# EAGLE schematic Teensy-Maxuino-Slave (EAGLE 6.4)
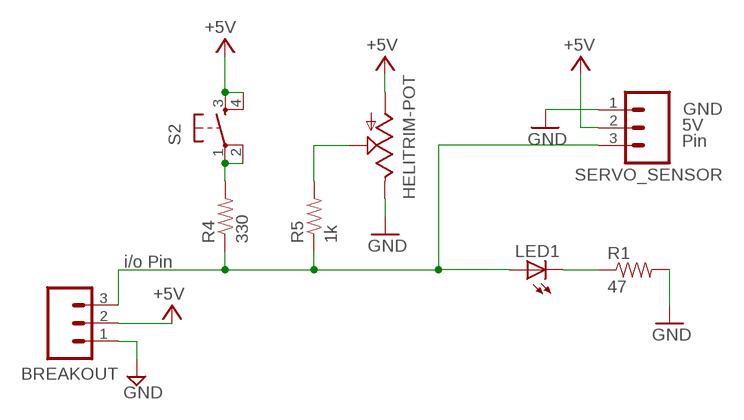
[diagram p0: schematic, sheet 1]

## Parts
BREAKOUT  M03PTH  [1X03]
LED1  LED3MM  [LED3MM]
R1  47  RESISTORPTH-1/6W  [1/6W-RES]
R4  330  RESISTORPTH-1/6W  [1/6W-RES]
R5  1k  RESISTORPTH-1/6W  [1/6W-RES]
S2  TAC_SWITCHPTH  [TACTILE-PTH]
SERVO_SENSOR  M03PTH  [1X03]
U$1  HELITRIM-POT  [HELITRIM-POT]

## Nets
+5V [Power]: BREAKOUT.2 S2.3 S2.4 SERVO_SENSOR.2 U$1.P$1(A)
GND: BREAKOUT.1 R1.2 SERVO_SENSOR.1 U$1.P$2(E)
N$2 [Power]: R4.2 S2.1 S2.2
N$3: R5.2 U$1.P$3(S)
N$4: LED1.K(C) R1.1
PIN: BREAKOUT.3 LED1.A R4.1 R5.1 SERVO_SENSOR.3

## Library data of the parts
BREAKOUT = SparkFun-Connectors:M03: Header 3 Standard 3-pin 0.1" header. Use with straight break away headers (SKU : PRT-00116), right angle break away headers (PRT-00553), swiss pins (PRT-00743), machine pins (PRT-00117), and female headers (PRT-00115). Molex polarized connector foot print use with SKU : PRT-08232 with associated crimp pins and housings.; IOPIN: i/o Pin
LED1 = SparkFun-LED:LED: LEDs Standard schematic elements and footprints for 5mm, 3mm, 1206, and 0603 sized LEDs. 5mm - Spark Fun Electronics SKU : COM-00529 (and others)
R1 R4 R5 = SparkFun-Resistors:RESISTOR: Resistor Basic schematic elements and footprints for 0603, 1206, and PTH resistors.
S2 = SparkFun-Electromechanical:TAC_SWITCH: Momentary Switch Button commonly used for reset or general input. Spark Fun Electronics SKU : COM-00097 SMT- SWCH-08247
SERVO_SENSOR = SparkFun:M03: Header 3 Standard 3-pin 0.1" header. Use with straight break away headers (SKU : PRT-00116), right angle break away headers (PRT-00553), swiss pins (PRT-00743), machine pins (PRT-00117), and female headers (PRT-00115). Molex polarized connector foot print use with SKU : PRT-08232 with associated crimp pins and housings.; 5V: 5V; GND: 0; PIN: Pin
U$1 = aliEagleLib:HELITRIM-POT

## Net classes
1 GND: width 0.457 mm
2 Power: width 0.813 mm